# Altium project LM5161 Buck Converter_12Vout.PrjPcb (part 1 of 2)
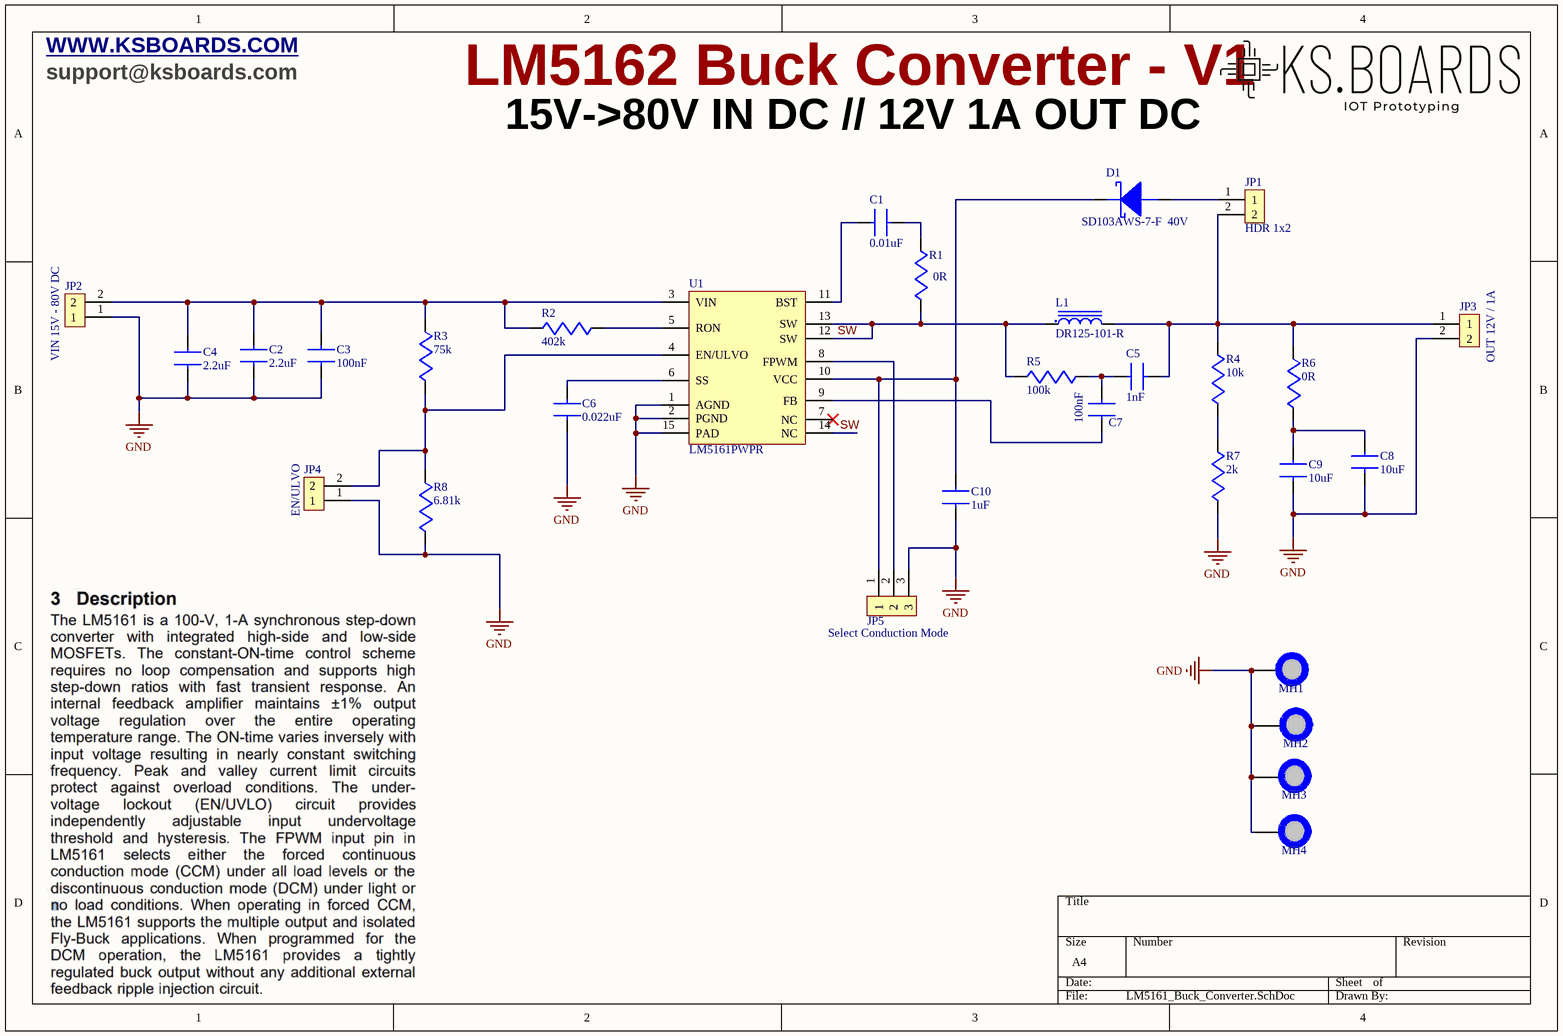
[diagram p0: LM5161_Buck_Converter.SchDoc]
1 sheet, 30 parts. Net scope: global (net labels, ports and power ports of the same name join across sheets).
Board file: LM5161_Buck_PCB.PcbDoc

## Sheet LM5161_Buck_Converter.SchDoc
size A4

### Parts
C1  0.01uF  [C0603]
C2  2.2uF  [C0603]
C3  100nF  [C0603]
C4  2.2uF  [C0603]
C5  1nF  [C0603]
C6  0.022uF  [C0603]
C7  100nF  [C0603]
C8  10uF  [C0603]
C9  10uF  [C0603]
C10  1uF  [C0603]
D1  SD103AWS-7-F  40V  [SOD323]
JP1  HDR 1x2  [HDR_FEMALE_1x2_2.54mm]
JP2  VIN 15V - 80V DC  [HDR_FEMALE_1x2_2.54mm]
JP3  OUT 12V / 1A  [HDR_FEMALE_1x2_2.54mm]
JP4  EN/ULVO  [HDR_FEMALE_1x2_2.54mm]
JP5  Select Conduction Mode  [HDR_FEMALE_1x3_2.54mm]
L1  DR125-101-R  [IND2PADS]
MH1  MH_3.5MM_3.5MMD  [MH_3.5MMX3.5MM]  (value not drawn)  (no BOM)
MH2  MH_3.5MM_3.5MMD  [MH_3.5MMX3.5MM]  (value not drawn)  (no BOM)
MH3  MH_3.5MM_3.5MMD  [MH_3.5MMX3.5MM]  (value not drawn)  (no BOM)
MH4  MH_3.5MM_3.5MMD  [MH_3.5MMX3.5MM]  (value not drawn)  (no BOM)
R1  0R  [R0603]
R2  402k  [R0603]
R3  75k  [R0603]
R4  10k  [R0603]
R5  100k  [R0603]
R6  0R  [R0603]
R7  2k  [R0603]
R8  6.81k  [R0603]
U1  LM5161PWPR  [SOP15]

### Nets
GND: C2.1 C3.1 C4.1 C6.1 C8.1 C9.1 C10.1 JP2.1 JP3.2 JP4.1 JP5.3 MH1.1 MH2.1 MH3.1 MH4.1 R7.1 R8.1 U1.1(AGND) U1.2(PGND) U1.15(PAD)
SW: L1.1 R1.1 R5.1 U1.12(SW) U1.13(SW) U1.14(NC)
NetC1_1: C1.1 U1.11(BST)
NetC1_2: C1.2 R1.2
NetC2_2: C2.2 C3.2 C4.2 JP2.2 R2.1 R3.2 U1.3(VIN)
NetC5_1: C5.1 JP1.2 JP3.1 L1.2 R4.2 R6.2
NetC5_2: C5.2 C7.2 R5.2
NetC6_2: C6.2 U1.6(SS)
NetC7_1: C7.1 U1.9(FB)
NetC8_2: C8.2 C9.2 R6.1
NetC10_2: C10.2 D1.2(Cathode) JP5.1 U1.10(VCC)
NetD1_1: D1.1(Anode) JP1.1
NetJP4_2: JP4.2 R3.1 R8.2 U1.4(EN/ULVO)
NetJP5_2: JP5.2 U1.8(FPWM)
NetR2_2: R2.2 U1.5(RON)
NetR4_1: R4.1 R7.2

Not connected (* = marked no-connect by the designer): U1 7(NC)*

### Notes on the sheet
- WWW.KSBOARDS.COM <http://WWW.KSBOARDS.COM>
- support@ksboards.com
- LM5162 Buck Converter - V1
- 15V->80V IN DC // 12V 1A OUT DC